# EAGLE design Terminierung_RS485-005 (EAGLE 7.6.0)
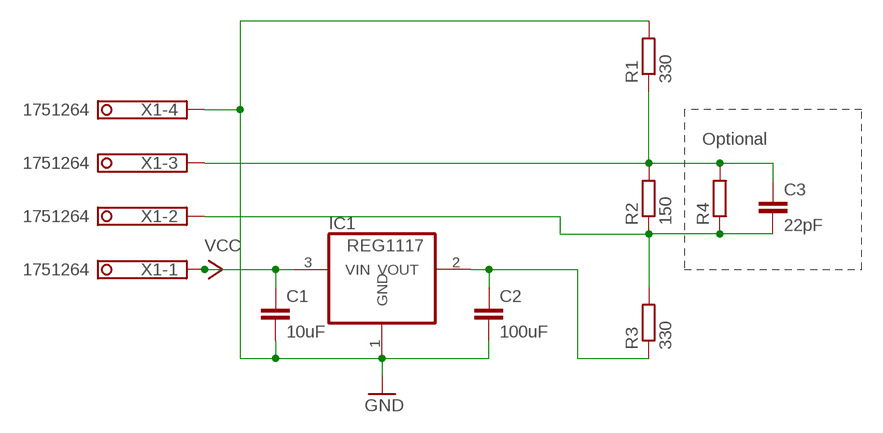
[diagram p0: schematic, sheet 1]

## Parts
C1  10uF  C-EUC0805K  [C0805K]
C2  100uF  C-EUC0805K  [C0805K]
C3  22pF  C-EUC0805K  [C0805K]
IC1  REG1117  [SOT223]
R1  330  R-EU_R0805  [R0805]
R2  150  R-EU_R0805  [R0805]
R3  330  R-EU_R0805  [R0805]
R4  R-EU_M1206  [M1206]
X1  1751264  [1751264]

## Nets
GND [Power]: C1.2 C2.2 IC1.1(GND) R1.2 X1.4
N$2: C2.1 IC1.2(VOUT) R3.1
N$3: C3.1 R1.1 R2.2 R4.2 X1.3
N$4: C3.2 R2.1 R3.2 R4.1 X1.2
VCC [Power]: C1.1 IC1.3(VIN) X1.1

## Notes on the sheet
- Optional

## Library data of the parts
C1-C3 = resistor:C-EU: CAPACITOR, European symbol
IC1 = burr-brown:REG1117: 800mA and 1A Low Dropout (LDO) Positive Regulator 1.8V, 2.5V, 2.85V, 3.3V, 5V, and Adj; MPN: REG1117; OC_FARNELL: 1097566; OC_NEWARK: 14P6981
R1-R4 = resistor:R-EU_: RESISTOR, European symbol
X1 = con-phoenix-350:1751264: MKDS 1/ 4-3,5 Printklemme Nennstrom: 10 A Bemessungsspannung: 160 V Raster: 3,5 mm Polzahl: 4 Montageart: Löten Anschlussart: Schraubanschluss Anschlussrichtung vom Leiter zur Platine: 0° Source: http://eshop.phoenixcontact.com .. 1751264.pdf; MF: VIN; MPN: 1751264; OC_FARNELL: unknown; OC_NEWARK: 10R0934

## Net classes
0 default: width 0.406 mm
1 Power: width 0.61 mm

## Board
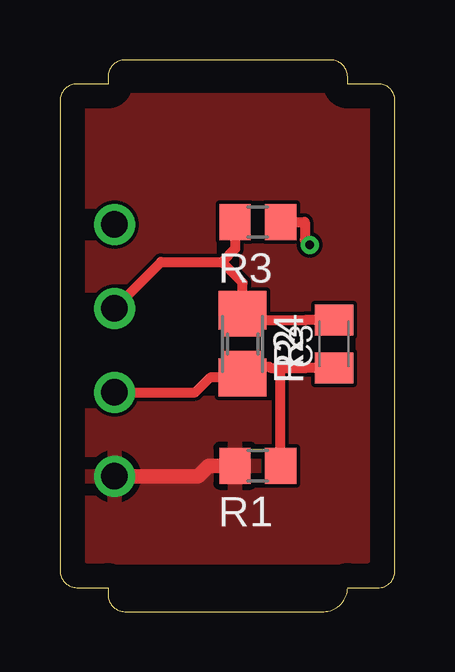
[diagram p1: board, top side]
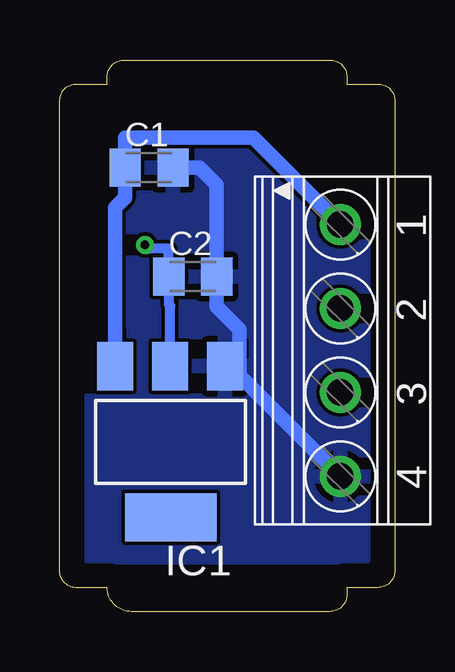
[diagram p2: board, bottom side, seen from below]

Size 13.97 x 23 mm. Coordinates in mm from the lower left corner, seen from the top.
Outline: 0,21.29 0,1.71 arc90 0.71,1 2,1 2,0.71 arc90 2.71,0 11,0 arc90 12,1 13.27,1 arc90 13.97,1.64 13.97,21.32 arc90 13.29,22 12,22 12,22.29 arc90 11.29,23 2.71,23 arc90 2,22.29 2,22 0.71,22 arc90 0,21.29
Copper layers (1*16): Top 0.035mm / dielectric 1.5mm / Bottom 0.035mm
Design rules "default": minimum track width 6mil, minimum drill 0.35mm, track to track 6mil, track to pad 6mil, pad to pad 6mil, via to via 6mil, smd to smd 6mil, copper to edge 40mil, drill to drill 6mil, minimum pad ring 10mil, minimum via ring 8mil, stop-mask expansion 4mil, vias tented up to drill 0mil, thermal gap 10mil

### Footprints (pad centres in the part's own frame; a part is rotated, then mirrored left to right if it is on the bottom)
C0805K = smd 1.3 x 1.6: 1 -1,0; 2 1,0
SOT223 = smd 1.499 x 2.007: 1 -2.261,-3.15; 2 0.025,-3.15; 3 2.311,-3.15 | smd 3.81 x 2.007: 4 0,3.15
R0805 = smd 1.3 x 1.5: 1 -0.95,0; 2 0.95,0
M1206 = smd 1.6 x 2: 1 -1.4,0; 2 1.4,0
1751264 = drill 1.1 pad 1.7: 1 -5.25,-0.1; 2 -1.75,-0.1; 3 1.75,-0.1; 4 5.25,-0.1

### Placement (x,y rotation side)
C1  10.26,18.51 0 bottom
C2  8.43,13.97 0 bottom
C3  11.43,11.16 90 top
IC1  9.35,7.08 180 bottom
R1  8.26,6.08 180 top
R2  7.62,11.16 270 top
R3  8.26,16.24 180 top
R4  7.62,11.16 270 top
X1  2.17,10.89 270 bottom

### Tracks (layer width: path | path; a pad name or v marks a point on that pad's centre or on a via)
GND
  Top 0.61: R1.2 6.2,6.08 5.76,5.64 X1.4
  Bottom 0.61: X1.4 6.49,9.85 6.49,10.23 | 6.49,10.23 6.49,11.77 7.43,12.71 C2.2 7.43,17.79 8.15,18.51 C1.2 | IC1.1 6.49,10.23
  pour Top: 1.27,2.27 1.27,21.32 12.7,21.32 12.7,2.27
  pour Bottom: 1.27,2.27 1.27,21.32 12.7,21.32 12.7,2.27
N$2  (via drill 0.35 pad 0.76)
  Top 0.406: R3.1 10.21,16.24 10.21,15.5 v10.42,15.29
  Bottom 0.406: v10.42,15.29 10.26,15.13 9.43,15.13 C2.1 9.43,12.81 9.38,12.76 IC1.2
N$3
  Top 0.406: 7.17,9.76 R2.2 8.73,10.21 8.78,10.16 9.21,10.16 | R4.2 7.17,9.76 | 7.17,9.76 6.94,9.76 6.26,9.76 5.64,9.14 X1.3 | 9.21,10.16 10.27,10.16 C3.1 | R1.1 9.21,10.16
N$4
  Top 0.406: 7.62,12.16 R4.1 7.62,13.72 6.75,14.58 | R2.1 7.62,12.16 | 7.62,12.16 10.27,12.16 C3.2 | X1.2 4.22,14.58 6.75,14.58 | 6.75,14.58 7.3,15.13 R3.2
VCC
  Bottom 0.61: X1.1 5.9,19.77 11.26,19.77 C1.1 11.26,17.88 11.26,17.25 11.66,16.85 11.66,11.69 IC1.3